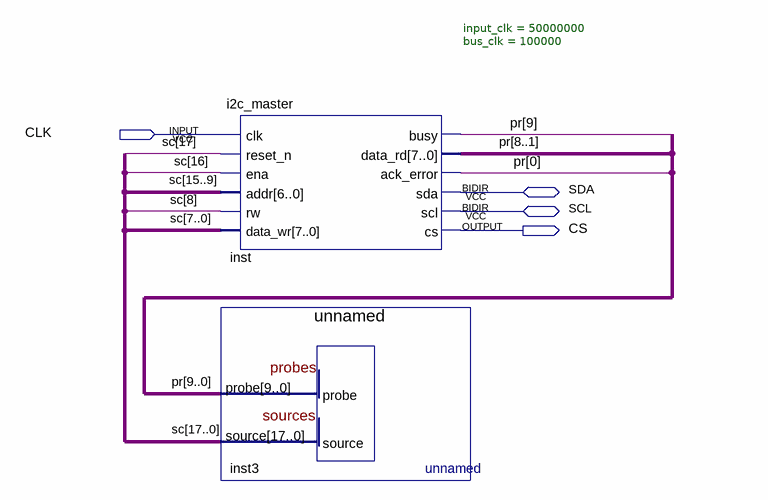
[diagram p0: schematic sheet]
// Quartus schematic i2c.bdf as structural Verilog: 2 symbols, 4 pins
module i2c (
  input  CLK,
  inout  SDA,
  inout  SCL,
  output CS
);

  wire [9:0] pr;
  wire [17:0] sc;

  i2c_master #(.input_clk(50000000), .bus_clk(100000)) inst (
    .clk(CLK), .reset_n(sc[17]), .ena(sc[16]), .addr(sc[15:9]), .rw(sc[8]), .data_wr(sc[7:0]), .busy(pr[9]),
    .data_rd(pr[8:1]), .ack_error(pr[0]), .cs(CS), .sda(SDA), .scl(SCL));
  unnamed inst3 (.probe(pr), .source(sc));
endmodule
